# EAGLE schematic 8x8matrix_tlc3 (EAGLE 6.5.0)
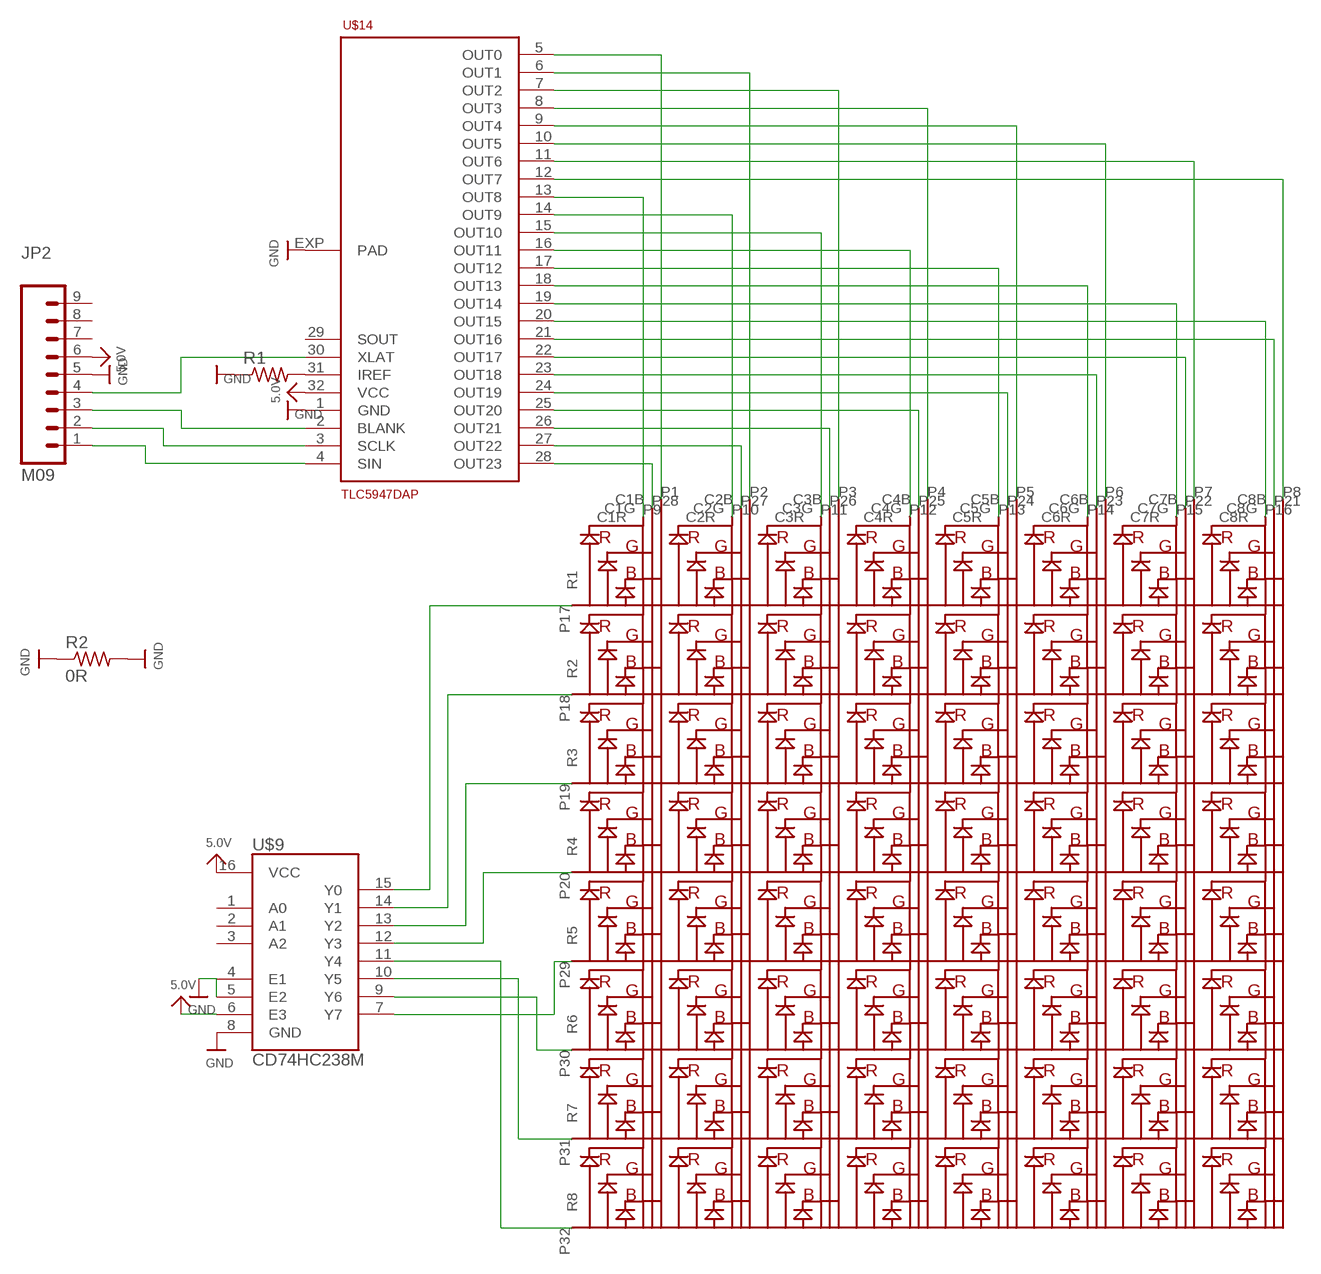
[diagram p0: schematic, sheet 1]

## Parts
JP2  M09  [1X09]
R1  R-US_R0805  [R0805]
R2  0R  R-US_M1206  [M1206]
U$1  GTM2088ARGB  [8X8MATRIX]
U$9  CD74HC238M  [SO-16]
U$14  TLC5947DAP  [HTSSOP32DAP]

## Nets
5.0V: JP2.6 U$9.6(E3) U$9.16(VCC) U$14.32(VCC)
BLANK: JP2.3 U$14.2(BLANK)
GND: JP2.5 R1.1 R2.1 R2.2 U$9.4(E1) U$9.5(E2) U$9.8(GND) U$14.1(GND) U$14.EXP(PAD)
N$1: U$1.P1(C1B) U$14.5(OUT0)
N$2: U$1.P2(C2B) U$14.6(OUT1)
N$3: U$1.P3(C3B) U$14.7(OUT2)
N$4: U$1.P4(C4B) U$14.8(OUT3)
N$5: U$1.P5(C5B) U$14.9(OUT4)
N$6: U$1.P6(C6B) U$14.10(OUT5)
N$7: U$1.P7(C7B) U$14.11(OUT6)
N$8: U$1.P8(C8B) U$14.12(OUT7)
N$9: U$1.P9(C1R) U$14.13(OUT8)
N$10: U$1.P10(C2R) U$14.14(OUT9)
N$11: U$1.P11(C3R) U$14.15(OUT10)
N$12: U$1.P12(C4R) U$14.16(OUT11)
N$13: U$1.P13(C5R) U$14.17(OUT12)
N$14: U$1.P14(C6R) U$14.18(OUT13)
N$15: U$1.P15(C7R) U$14.19(OUT14)
N$16: U$1.P16(C8R) U$14.20(OUT15)
N$17: U$1.P21(C8G) U$14.21(OUT16)
N$18: U$1.P22(C7G) U$14.22(OUT17)
N$19: U$1.P23(C6G) U$14.23(OUT18)
N$20: U$1.P24(C5G) U$14.24(OUT19)
N$21: U$1.P25(C4G) U$14.25(OUT20)
N$22: U$1.P26(C3G) U$14.26(OUT21)
N$23: U$1.P27(C2G) U$14.27(OUT22)
N$24: U$1.P28(C1G) U$14.28(OUT23)
N$25: JP2.4 U$14.30(XLAT)
N$26: U$1.P30(R6) U$9.9(Y6)
N$27: R1.2 U$14.31(IREF)
N$28: JP2.2 U$14.3(SCLK)
N$29: U$1.P31(R7) U$9.10(Y5)
N$30: U$1.P32(R8) U$9.11(Y4)
N$31: U$1.P20(R4) U$9.12(Y3)
N$32: U$1.P19(R3) U$9.13(Y2)
N$33: U$1.P18(R2) U$9.14(Y1)
N$34: U$1.P17(R1) U$9.15(Y0)
N$35: U$1.P29(R5) U$9.7(Y7)
SIN: JP2.1 U$14.4(SIN)
Unconnected: JP2.7 JP2.8 JP2.9 U$9.1(A0) U$9.2(A1) U$9.3(A2) U$14.29(SOUT)

## Library data of the parts
JP2 = SparkFun-Connectors:M09: Header 9 Standard 9-pin 0.1" header. Use with straight break away headers (SKU : PRT-00116), right angle break away headers (PRT-00553), swiss pins (PRT-00743), machine pins (PRT-00117), and female headers (PRT-00115).
R1 R2 = resistor:R-US_: RESISTOR, American symbol
U$1 = mylib:GTM2088ARGB: a 8x8 RGB matrix
U$9 = mylib:CD74HC238: M74HC238 - CMOS 3 TO 8 LINE DECODER
U$14 = TLC5947:TLC5947